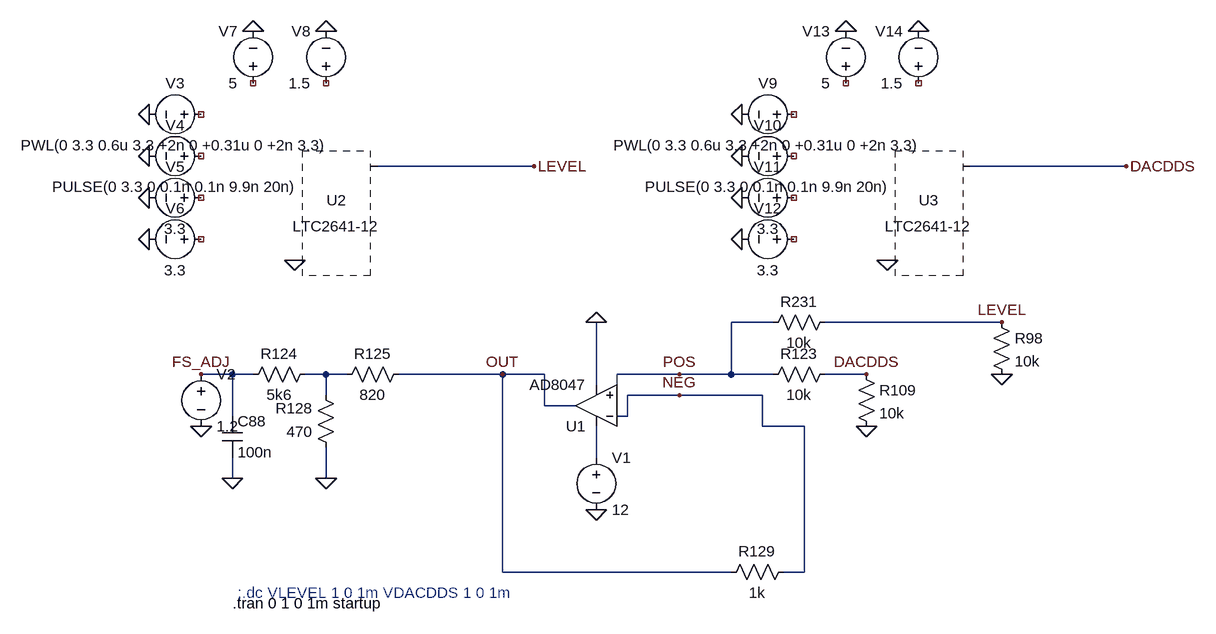
[diagram p0: schematic level_dacdds.asc]
level_dacdds.asc, the LTspice schematic file:
Version 4
SHEET 1 2440 728
WIRE 304 -192 64 -192
WIRE 1216 -192 976 -192
WIRE 672 48 608 48
WIRE 1024 48 752 48
WIRE -160 128 -208 128
WIRE -128 128 -160 128
WIRE -16 128 -48 128
WIRE 16 128 -16 128
WIRE 256 128 96 128
WIRE 320 128 256 128
WIRE 528 128 432 128
WIRE 608 128 608 48
WIRE 608 128 528 128
WIRE 672 128 608 128
WIRE 816 128 752 128
WIRE 400 144 400 48
WIRE -16 160 -16 128
WIRE 432 160 432 128
WIRE 528 160 448 160
WIRE 656 160 528 160
WIRE 320 176 320 128
WIRE 368 176 320 176
WIRE -160 192 -160 128
WIRE 448 192 448 160
WIRE 448 192 432 192
WIRE 656 208 656 160
WIRE 720 208 656 208
WIRE 400 256 400 208
WIRE -160 288 -160 256
WIRE -16 288 -16 240
WIRE 256 432 256 128
WIRE 608 432 256 432
WIRE 720 432 720 208
WIRE 720 432 688 432
FLAG 400 336 0
FLAG -160 288 0
FLAG -16 288 0
FLAG -208 128 FS_ADJ
FLAG 528 128 POS
FLAG 528 160 NEG
FLAG 256 128 OUT
FLAG -208 208 0
FLAG 400 48 0
FLAG 816 208 0
FLAG 1024 128 0
FLAG -288 -80 0
FLAG -288 -144 0
FLAG -288 -208 0
FLAG -288 -272 0
FLAG -128 -400 0
FLAG -16 -400 0
FLAG -64 -48 0
FLAG 624 -80 0
FLAG 624 -144 0
FLAG 624 -208 0
FLAG 624 -272 0
FLAG 784 -400 0
FLAG 896 -400 0
FLAG 848 -48 0
FLAG 1216 -192 DACDDS
FLAG 304 -192 LEVEL
FLAG 1024 48 LEVEL
FLAG 816 128 DACDDS
SYMBOL res 768 112 R90
WINDOW 0 0 56 VBottom 2
WINDOW 3 32 56 VTop 2
SYMATTR InstName R123
SYMATTR Value 10k
SYMBOL res 656 64 R270
WINDOW 0 32 56 VTop 2
WINDOW 3 0 56 VBottom 2
SYMATTR InstName R231
SYMATTR Value 10k
SYMBOL voltage 400 240 R0
WINDOW 123 0 0 Left 2
WINDOW 39 0 0 Left 2
SYMATTR InstName V1
SYMATTR Value 12
SYMBOL res 704 416 R90
WINDOW 0 0 56 VBottom 2
WINDOW 3 32 56 VTop 2
SYMATTR InstName R129
SYMATTR Value 1k
SYMBOL res 112 112 R90
WINDOW 0 0 56 VBottom 2
WINDOW 3 32 56 VTop 2
SYMATTR InstName R125
SYMATTR Value 820
SYMBOL res 0 256 R180
WINDOW 0 36 76 Left 2
WINDOW 3 36 40 Left 2
SYMATTR InstName R128
SYMATTR Value 470
SYMBOL res -144 144 R270
WINDOW 0 32 56 VTop 2
WINDOW 3 0 56 VBottom 2
SYMATTR InstName R124
SYMATTR Value 5k6
SYMBOL cap -176 192 R0
SYMATTR InstName C88
SYMATTR Value 100n
SYMBOL voltage -208 112 R0
WINDOW 123 0 0 Left 2
WINDOW 39 0 0 Left 2
SYMATTR InstName V2
SYMATTR Value 1.2
SYMBOL Opamps\\AD8047 400 240 R180
SYMATTR InstName U1
SYMBOL res 800 112 R0
SYMATTR InstName R109
SYMATTR Value 10k
SYMBOL res 1008 32 R0
SYMATTR InstName R98
SYMATTR Value 10k
SYMBOL voltage -192 -272 R90
WINDOW 0 -32 56 VBottom 2
WINDOW 3 32 56 VTop 2
SYMATTR InstName V3
SYMATTR Value PWL(0 3.3 0.6u 3.3 +2n 0 +0.31u 0 +2n 3.3)
SYMBOL voltage -192 -208 R90
WINDOW 0 -32 56 VBottom 2
WINDOW 3 32 56 VTop 2
SYMATTR InstName V4
SYMATTR Value PULSE(0 3.3 0 0.1n 0.1n 9.9n 20n)
SYMBOL SpecialFunctions\\LTC2641-12 -64 -176 R0
SYMATTR InstName U2
SYMBOL voltage -192 -144 R90
WINDOW 0 -32 56 VBottom 2
WINDOW 3 32 56 VTop 2
WINDOW 123 0 0 Left 2
WINDOW 39 0 0 Left 2
SYMATTR InstName V5
SYMATTR Value 3.3
SYMBOL voltage -192 -80 R90
WINDOW 0 -32 56 VBottom 2
WINDOW 3 32 56 VTop 2
SYMATTR InstName V6
SYMATTR Value 3.3
SYMBOL voltage -128 -304 R180
WINDOW 0 24 96 Left 2
WINDOW 3 24 16 Left 2
WINDOW 123 0 0 Left 2
WINDOW 39 0 0 Left 2
SYMATTR InstName V7
SYMATTR Value 5
SYMBOL voltage -16 -304 R180
WINDOW 0 24 96 Left 2
WINDOW 3 24 16 Left 2
WINDOW 123 0 0 Left 2
WINDOW 39 0 0 Left 2
SYMATTR InstName V8
SYMATTR Value 1.5
SYMBOL voltage 720 -272 R90
WINDOW 0 -32 56 VBottom 2
WINDOW 3 32 56 VTop 2
SYMATTR InstName V9
SYMATTR Value PWL(0 3.3 0.6u 3.3 +2n 0 +0.31u 0 +2n 3.3)
SYMBOL voltage 720 -208 R90
WINDOW 0 -32 56 VBottom 2
WINDOW 3 32 56 VTop 2
SYMATTR InstName V10
SYMATTR Value PULSE(0 3.3 0 0.1n 0.1n 9.9n 20n)
SYMBOL SpecialFunctions\\LTC2641-12 848 -176 R0
SYMATTR InstName U3
SYMBOL voltage 720 -144 R90
WINDOW 0 -32 56 VBottom 2
WINDOW 3 32 56 VTop 2
WINDOW 123 0 0 Left 2
WINDOW 39 0 0 Left 2
SYMATTR InstName V11
SYMATTR Value 3.3
SYMBOL voltage 720 -80 R90
WINDOW 0 -32 56 VBottom 2
WINDOW 3 32 56 VTop 2
SYMATTR InstName V12
SYMATTR Value 3.3
SYMBOL voltage 784 -304 R180
WINDOW 0 24 96 Left 2
WINDOW 3 24 16 Left 2
WINDOW 123 0 0 Left 2
WINDOW 39 0 0 Left 2
SYMATTR InstName V13
SYMATTR Value 5
SYMBOL voltage 896 -304 R180
WINDOW 0 24 96 Left 2
WINDOW 3 24 16 Left 2
WINDOW 123 0 0 Left 2
WINDOW 39 0 0 Left 2
SYMATTR InstName V14
SYMATTR Value 1.5
TEXT -160 480 Left 2 !.tran 0 1 0 1m startup
TEXT -152 464 Left 2 ;;.dc VLEVEL 1 0 1m VDACDDS 1 0 1m

The netlist it stands for:
* level_dacdds.asc
R123 DACDDS POS 10k
R231 POS LEVEL 10k
V1 N002 0 12
R129 NEG OUT 1k
R125 OUT N001 820
R128 0 N001 470
R124 FS_ADJ N001 5k6
C88 FS_ADJ 0 100n
V2 FS_ADJ 0 1.2
XU1 POS NEG N002 0 OUT AD8047  ; pins In+ In- V+ V- OUT
R109 DACDDS 0 10k
R98 LEVEL 0 10k
V3 NC_01 0 PWL(0 3.3 0.6u 3.3 +2n 0 +0.31u 0 +2n 3.3)
V4 NC_02 0 PULSE(0 3.3 0 0.1n 0.1n 9.9n 20n)
* U2: LTC2641-12 (symbol SpecialFunctions\LTC2641-12 not available, pin order unknown); nets seen at it: 0, LEVEL
V5 NC_03 0 3.3
V6 NC_04 0 3.3
V7 NC_05 0 5
V8 NC_06 0 1.5
V9 NC_07 0 PWL(0 3.3 0.6u 3.3 +2n 0 +0.31u 0 +2n 3.3)
V10 NC_08 0 PULSE(0 3.3 0 0.1n 0.1n 9.9n 20n)
* U3: LTC2641-12 (symbol SpecialFunctions\LTC2641-12 not available, pin order unknown); nets seen at it: 0, DACDDS
V11 NC_09 0 3.3
V12 NC_10 0 3.3
V13 NC_11 0 5
V14 NC_12 0 1.5
.tran 0 1 0 1m startup
* ;.dc VLEVEL 1 0 1m VDACDDS 1 0 1m
.backanno
.end